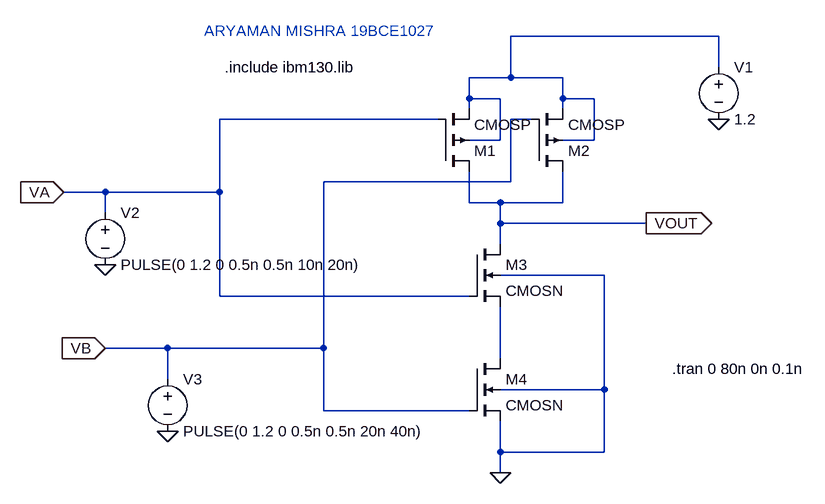
[diagram p0: schematic exp6_task5.asc]
exp6_task5.asc, the LTspice schematic file:
Version 4
SHEET 1 880 680
WIRE 608 -176 288 -176
WIRE 608 -128 608 -176
WIRE 288 -112 288 -176
WIRE 288 -112 224 -112
WIRE 368 -112 288 -112
WIRE 224 -80 224 -112
WIRE 272 -80 224 -80
WIRE 368 -80 368 -112
WIRE 416 -80 368 -80
WIRE 224 -64 224 -80
WIRE 368 -64 368 -80
WIRE 176 -48 -160 -48
WIRE 320 -48 288 -48
WIRE 272 -16 272 -80
WIRE 272 -16 224 -16
WIRE 416 -16 416 -80
WIRE 416 -16 368 -16
WIRE 288 48 288 -48
WIRE 288 48 0 48
WIRE -336 64 -400 64
WIRE -160 64 -160 -48
WIRE -160 64 -336 64
WIRE 224 80 224 32
WIRE 272 80 224 80
WIRE 368 80 368 32
WIRE 368 80 272 80
WIRE -336 96 -336 64
WIRE 272 112 272 80
WIRE 496 112 272 112
WIRE 272 144 272 112
WIRE 432 192 272 192
WIRE -160 224 -160 64
WIRE 224 224 -160 224
WIRE -240 304 -336 304
WIRE 0 304 0 48
WIRE 0 304 -240 304
WIRE 272 320 272 240
WIRE -240 352 -240 304
WIRE 432 368 432 192
WIRE 432 368 272 368
WIRE 0 400 0 304
WIRE 224 400 0 400
WIRE 272 464 272 416
WIRE 432 464 432 368
WIRE 432 464 272 464
WIRE 272 496 272 464
FLAG 272 496 0
FLAG 608 -48 0
FLAG -240 432 0
FLAG -336 176 0
FLAG -400 64 VA
IOPIN -400 64 In
FLAG -336 304 VB
IOPIN -336 304 In
FLAG 496 112 VOUT
IOPIN 496 112 Out
SYMBOL voltage 608 -144 R0
WINDOW 123 0 0 Left 0
WINDOW 39 0 0 Left 0
SYMATTR InstName V1
SYMATTR Value 1.2
SYMBOL CMOSN 224 144 R0
SYMATTR InstName M3
SYMATTR Value2 l=130n w=200n
SYMBOL CMOSN 224 320 R0
SYMATTR InstName M4
SYMATTR Value2 l=130n w=200n
SYMBOL voltage -336 80 R0
WINDOW 123 0 0 Left 0
WINDOW 39 24 124 Left 2
SYMATTR InstName V2
SYMATTR Value PULSE(0 1.2 0 0.5n 0.5n 10n 20n)
SYMBOL voltage -240 336 R0
WINDOW 123 0 0 Left 0
WINDOW 39 24 124 Left 2
SYMATTR InstName V3
SYMATTR Value PULSE(0 1.2 0 0.5n 0.5n 20n 40n)
SYMBOL CMOSP 176 32 M180
SYMATTR InstName M1
SYMATTR Value2 l=130n w=200n
SYMBOL CMOSP 320 32 M180
SYMATTR InstName M2
SYMATTR Value2 l=130n w=200n
TEXT -152 -128 Left 2 !.include ibm130.lib
TEXT -184 -184 Left 2 ;ARYAMAN MISHRA 19BCE1027
TEXT 536 336 Left 2 !.tran 0 80n 0n 0.1n

The netlist it stands for:
* exp6_task5.asc
V1 N001 0 1.2
M3 VOUT VA N002 0 CMOSN l=130n w=200n
M4 N002 VB 0 0 CMOSN l=130n w=200n
V2 VA 0 PULSE(0 1.2 0 0.5n 0.5n 10n 20n)
V3 VB 0 PULSE(0 1.2 0 0.5n 0.5n 20n 40n)
M1 VOUT VA N001 N001 CMOSP l=130n w=200n
M2 VOUT VB N001 N001 CMOSP l=130n w=200n
.model NMOS NMOS
.model PMOS PMOS
.lib standard.mos
.include ibm130.lib
* ARYAMAN MISHRA 19BCE1027
.tran 0 80n 0n 0.1n
.backanno
.end

* Results of the author's LTspice run, read from the files saved beside the schematic
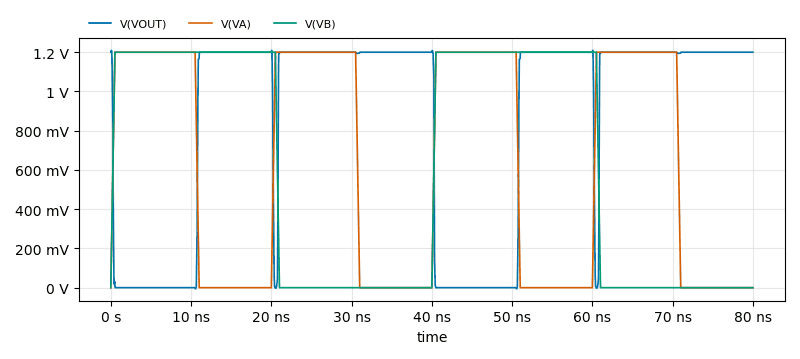
[diagram p1: Transient Analysis of exp6_task5.asc, plotted from the saved traces]
* Transient Analysis, 1 run:
*   V(VOUT): min -5.836 mV, max 1.209 V, average 866.5 mV, rms 1.017 V, last 1.2 V
*   V(VA): min 0 V, max 1.2 V, average 630 mV, rms 862.8 mV, last 0 V
*   V(VB): min 0 V, max 1.2 V, average 615 mV, rms 855.6 mV, last 0 V